# Altium project PPT_Cap_Charger.PrjPcb
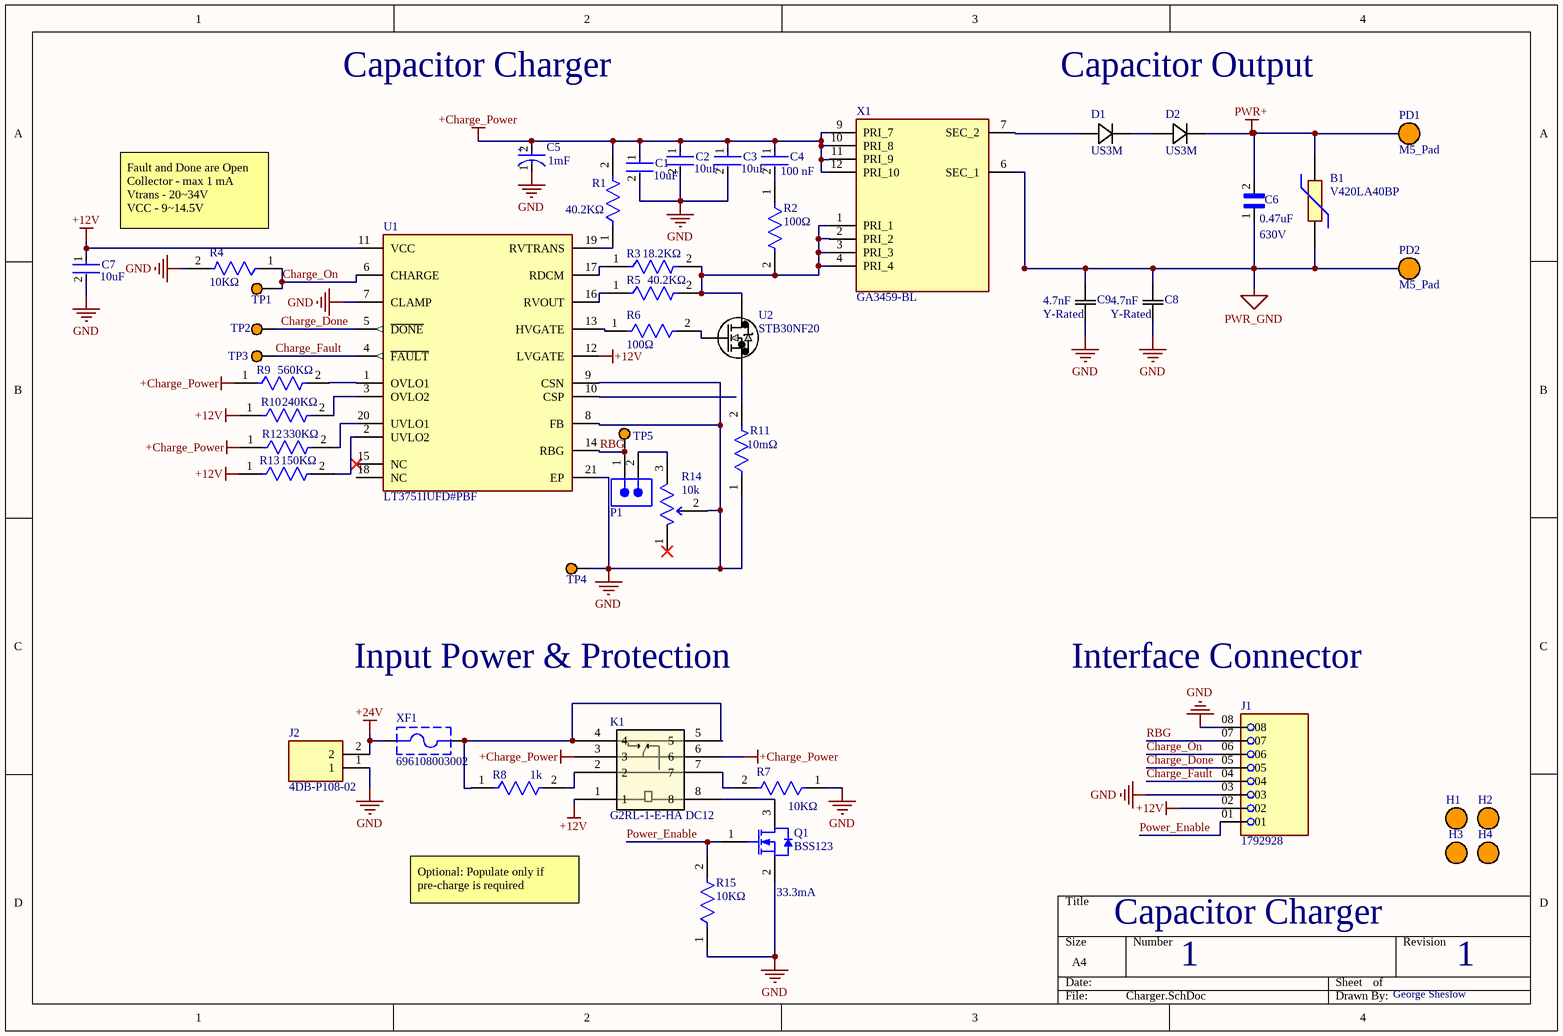
[diagram p0: Charger.SchDoc]
1 sheet, 47 parts. Net scope: global (net labels, ports and power ports of the same name join across sheets).
Board file: Charger.PcbDoc

## Sheet Charger.SchDoc
size A4; SheetNumber: 1; SheetTotal: 1

### Parts
B1  V420LA40BP  [V420LA40BP]
C1  Capacitance: 10uF  [FP-CL32-IPC_C]  (hidden comment: CL32B106KBJNNNE)
C2  Capacitance: 10uF  [FP-CL32-IPC_C]  (hidden comment: CL32B106KBJNNNE)
C3  Capacitance: 10uF  [FP-CL32-IPC_C]  (hidden comment: CL32B106KBJNNNE)
C4  Capacitance: 100 nF  [FP-CC0603-DA-MFG]  (hidden comment: CC0603KRX7R9BB104)
C5  Capacitance: 1mF  [FP-RAD-TH-D_12_5_0_5-L_25-MFG]  (hidden comment: ECA1HM102)
C6  value 0.47uF  voltage: 630V  [CAPC6050X550N]  (hidden comment: CKG57NX7R2J474M500JH)
C7  Capacitance: 10uF  [FP-CL32-IPC_C]  (hidden comment: CL32B106KBJNNNE)
C8  capacitance: 4.7nF  rating: Y-Rated  [CAP_5.0 X 11.0 X 13.0_EPC]  (hidden comment: B32021A3472M189)
C9  capacitance: 4.7nF  rating: Y-Rated  [CAP_5.0 X 11.0 X 13.0_EPC]  (hidden comment: B32021A3472M189)
D1  US3M  [DO-214AB_SMC]
D2  US3M  [DO-214AB_SMC]
H1  M3_Hole  [M3_Hole]  (value not drawn)
H2  M3_Hole  [M3_Hole]  (value not drawn)
H3  M3_Hole  [M3_Hole]  (value not drawn)
H4  M3_Hole  [M3_Hole]  (value not drawn)
J1  1792928  [PHOENIX_1792928]
J2  4DB-P108-02  [TE_2-1437667-4]
K1  G2RL-1-E-HA DC12  [RELAY_G2RL-1-E DC5_OMR]
P1  TSW-102-26-F-S  [SMTC-TSW-102-26-XX-S]  (value not drawn)
PD1  M5_Pad  [M5_Pad]
PD2  M5_Pad  [M5_Pad]
Q1  BSS123  [FAIR-SOT23-3_V]
R1  Resistance: 40.2KΩ  [FP-RT0805-MFG]  (hidden comment: RT0805BRE0740K2L)
R2  Resistance: 100Ω  [FP-RT0805-MFG]  (hidden comment: RT0805FRE07100RL)
R3  Resistance: 18.2KΩ  [FP-RT0805-MFG]  (hidden comment: RT0805BRE0718K2L)
R4  value 10KΩ  [FP-RT0805-MFG]  (hidden comment: RT0805FRE0710KL)
R5  Resistance: 40.2KΩ  [FP-RT0805-MFG]  (hidden comment: RT0805BRE0740K2L)
R6  Resistance: 100Ω  [FP-RT0805-MFG]  (hidden comment: RT0805FRE07100RL)
R7  value 10KΩ  [FP-RT0805-MFG]  (hidden comment: RT0805FRE0710KL)
R8  Resistance: 1k  [FP-CRCW2512-e3-IPC_A]  (hidden comment: CRCW25121K00JNEG)
R9  Resistance: 560KΩ  [FP-RT0805-MFG]  (hidden comment: RT0805FRE07560KL)
R10  Resistance: 240KΩ  [FP-RT0805-MFG]  (hidden comment: RT0805BRE07240KL)
R11  Resistance: 10mΩ  [FP-PCS2512-MFG]  (hidden comment: PCS2512DR0100ET)
R12  value 330KΩ  [FP-RT0805-MFG]  (hidden comment: RT0805FRE07330KL)
R13  value 150KΩ  [FP-RT0805-MFG]  (hidden comment: RT0805BRE07150KL)
R14  Resistance: 10k  [FP-3296W-MFG]  (hidden comment: 3296W-1-103RLF)
R15  value 10KΩ  [FP-RT0805-MFG]  (hidden comment: RT0805FRE0710KL)
TP1  Test Point  [Test_Pad]  (value not drawn)
TP2  Test Point  [Test_Pad]  (value not drawn)
TP3  Test Point  [Test_Pad]  (value not drawn)
TP4  Test Point  [Test_Pad]  (value not drawn)
TP5  Test Point  [Test_Pad]  (value not drawn)
U1  LT3751IUFD#PBF  [FP-UFD-20-05-08-1711-MFG]
U2  STB30NF20  [D2PAK_STM]
X1  GA3459-BL  [GA3459BL]
XF1  696108003002  [696108003002]

### Nets
+12V: C7.1 J1.02 K1.1 R10.1 R13.1 U1.11(VCC) U1.12(LVGATE)
+24V: J2.2 XF1.1
+Charge_Power: C1.1 C2.1 C3.1 C4.1 C5.2(A) K1.3 K1.6 R1.2 R9.1 R12.1 X1.9(PRI_7) X1.10(PRI_8) X1.11(PRI_9) X1.12(PRI_10)
GND: C1.2 C2.2 C3.2 C5.1(C) C7.2 C8.1 C9.1 J1.03 J1.08 J2.1 Q1.2(S) R4.2 R7.1 R11.1 R14.2(WIPER) R15.1 TP4.1(T) U1.7(CLAMP) U1.8(FB) U1.9(CSN) U1.21(EP)
PWR+: B1.2 C6.2 D2.K PD1.1
PWR_GND: B1.1 C6.1 C8.2 C9.2 PD2.1 X1.6(SEC_1)
Charge_Done: J1.05 TP2.1(T) U1.5(~{DONE})
Charge_Fault: J1.04 TP3.1(T) U1.4(~{FAULT})
Charge_On: J1.06 R4.1 TP1.1(T) U1.6(CHARGE)
Power_Enable: J1.01 Q1.1(G) R15.2
RBG: J1.07 P1.1 TP5.1(T) U1.14(RBG)
NetC4_2: C4.2 R2.1
NetD1_A: D1.A X1.7(SEC_2)
NetD1_K: D1.K D2.A
NetK1_2: K1.2 R8.2
NetK1_4: K1.4 K1.5 R8.1 XF1.2
NetK1_7: K1.7 R7.2
NetK1_8: K1.8 Q1.3(D)
NetP1_2: P1.2 R14.3(CW)
NetR1_1: R1.1 U1.19(RVTRANS)
NetR2_2: R2.2 R3.2 R5.2 U2.2 X1.1(PRI_1) X1.2(PRI_2) X1.3(PRI_3) X1.4(PRI_4)
NetR3_1: R3.1 U1.17(RDCM)
NetR5_1: R5.1 U1.16(RVOUT)
NetR6_1: R6.1 U1.13(HVGATE)
NetR6_2: R6.2 U2.1
NetR9_2: R9.2 U1.1(OVLO1)
NetR10_2: R10.2 U1.3(OVLO2)
NetR11_2: R11.2 U2.3
NetR12_2: R12.2 U1.20(UVLO1)
NetR13_2: R13.2 U1.2(UVLO2)

Not connected (* = marked no-connect by the designer): R14 1(CCW)*; U1 10(CSP) 15(NC)* 18(NC)

### Notes on the sheet
- Capacitor Charger
- Capacitor Output
- Fault and Done are Open Collector - max 1 mA
  Vtrans - 20~34V
  VCC - 9~14.5V
- Input Power & Protection
- (near J1) Interface Connector
- Optional: Populate only if pre-charge is required
- (near Q1) 33.3mA
- 1
- George Sheslow
- (in symbol CMP-05427-001975-1) +

### Library data of the parts
B1 = V420LA40BP: Littelfuse LA Series Variable Resistor 600pF 100A, Clamping 1060V, Varistor 610  720V; Geometry.Height: 28mm; Mouser Part Number: 576-V420LA40BP; Mouser Price/Stock: https://www.mouser.co.uk/ProductDetail/Littelfuse/V420LA40BP?qs=%252BvNVc1OwqXLcs1GzcX8aHQ%3D%3D; Manufacturer_Name: LITTELFUSE; Manufacturer_Part_Number: V420LA40BP; Datasheet Link: https://www.littelfuse.com/~/media/electronics/datasheets/varistors/littelfuse_varistor_la_datasheet.pdf.pdf
C1-C3 C7 = CMP-2000-06110-2: Cap Ceramic 10uF 50V X7R ±10% SMD 1210 +125°C Embossed T/R; Material: Ceramic; Min Operating Temperature: -55°C; Depth: 2.5mm; Radiation Hardening: No; Packaging: Tape and Reel; Dielectric: X7R; Case Code (Metric): 3225; Height: 2.5mm; Thickness: 0.106inch; Voltage Rating (DC): 50V; Voltage Rating: 50V; Width: 0.098inch; Case Code (Imperial): 1210; Length: 3.2mm; Tolerance: 10%; Lead Free: Lead Free; Package Quantity: 1; Voltage: 50V; Mount: Surface Mount; Case/Package: 1210; Max Operating Temperature: 125°C
C4 = CMP-2100-03601-2: CAP CER 0.1UF 50V X7R 0603; Manufacturer: YAGEO; Material: Ceramic; Temperature Coefficient: 15%; Tolerance: 0.1; Value: 100 nF; Height: 0.9mm; Voltage: 50 V; ComponentLink2Description: Datasheet; Device Class L2: Capacitors; Temperature Range High: +125°C; Category: Cap; Footprint Url: http://www.yageo.com/exep/pages/download/literatures/UPY-C_GEN_24.pdf; ComponentLink2URL: http://www.yageo.com/documents/recent/UPY-GPHC_X7R_6.3V-to-50V_18.pdf; Package: CC0603-DA; Temperature: -55°C to +125°C; Voltage Rating: 50 V; Temperature Characteristic: X7R; Device Class L1: Passive Components; Temperature Range Low: -55°C; Manufacturer Part Number: CC0603KRX7R9BB104; RoHS: TRUE; Automotive: No; Device Class L3: Ceramic Capacitors; Octopart: https://octopart.com/cc0603krx7r9bb104-yageo-42244635; Mouser Description: Multilayer Ceramic Capacitor, CC Series, 0.1 - F, - 10%, X7R, 50 V, 0603 [1608 Metric]; Lead Free: Yes; Digikey Description: CAP CER 0.1UF 50V X7R 0603
C5 = CMP-05427-001975-1: Aluminum Electrolytic Capacitors (Radial Lead Type) 1000uF ±20% 50V; Lead Diameter: 0.6mm; Polarity: Polar; Lead/Base Style: Straight; Ripple Current: 1.05A; Life (Hours): 2000Hour; Dissipation Factor: 0.12%; Diameter: 12.5mm; Height: 25mm; Construction: RADIAL; Voltage Rating (DC): 50V; Tolerance: 20%; Package Quantity: 200; Min Operating Temperature: -40°C; Packaging: Bulk; Max Operating Temperature: 85°C; Case/Package: Radial; Radiation Hardening: No; Mount: Through Hole; Length: 25mm; Termination: Radial; Voltage Rating: 50V; RoHS Compliant: Yes; Height - Seated (Max): 1.063inch; REACH SVHC: No SVHC; Series: M; Lead Pitch: 5mm
C6 = CKG57NX7R2J474M500JH: 0.47ÂµF Â±20% 630V Ceramic Capacitor X7R Stacked SMD, 2 J-Lead; MF: TDK; Price: None; Purchase-URL: https://pricing.snapeda.com/search/part/CKG57NX7R2J474M500JH/?ref=eda; Check_prices: https://www.snapeda.com/parts/CKG57NX7R2J474M500JH/TDK/view-part/?ref=eda; Package: 6050 TDK; Availability: In Stock; SnapEDA_Link: https://www.snapeda.com/parts/CKG57NX7R2J474M500JH/TDK/view-part/?ref=snap; MP: CKG57NX7R2J474M500JH
C8 C9 = B32021A3472M189: No Description Available; Manufacturer_Name: TDK Epcos; Copyright: Copyright (C) 2025 Ultra Librarian. All rights reserved.; Manufacturer_Part_Number: B32021A3472M189
D1 D2 = US3M: Rectifier Diode, 1 Phase, 1 Element, 3A, 1000V V(RRM), Silicon, DO-214AB; Manufacturer: Diotec; Package Body Material: Plastic; Application(s): GENERAL PURPOSE; Forward Voltage: 1.7V; Non-rep Pk Forward Current-Max: 100A; Number of Elements: 1; Rep Pk Reverse Voltage-Max: 1kV; Reverse Recovery Time-Max: 0.075us; Qualification Status: Not Qualified; Supplier: Mouser; Supplier Part Number: 637-US3M; Manufacturer Part Number: US3M; RoHS: Yes; Category: Rectifier Diodes; Stock: 6011; Pricing: 1=0.4, 10=0.317, 50=0.317, 100=0.19, 1000=0.182, 10000=0.13 (USD); Pins: 2; Diode Element Material: SILICON; Package Shape: Rectangular; Terminal Finish: Tin; Min Operating Temperature: -50°C; Max Operating Temperature: 150°C; Diode Type: RECTIFIER; JESD-30 Code: R-PDSO-C2; Number of Phases: 1; Max Output current: 3A; Package Style: SMALL OUTLINEMeter; Surface Mount: Yes; Terminal Form: C BEND; Terminal Position: DUAL; JESD-609 Code: e3; Moisture Sensitivity Level: 1; Peak Reflow Temperature (Cel): 260°C; RoHS Compliant: Yes; Reach SVHC Compliant: No; JEDEC-95 Code: DO-214AB; ComponentLink1URL: https://datasheet.ciiva.com:443/pdfs/VipMasterIC/IC/DISE/DISE-S-A0001232619/DISE-S-A0001232619-1.pdf?src-supplier=IHS+Markit; ComponentLink1Description: https://datasheet.ciiva.com:443/pdfs/VipMasterIC/IC/DISE/DISE-S-A0001232619/DISE-S-A0001232619-1.pdf?src-supplier=IHS+Markit; ComponentLink2URL: https://datasheet.octopart.com/US3M-Diotec-datasheet-155920030.pdf?src-supplier=TME; ComponentLink2Description: https://datasheet.octopart.com/US3M-Diotec-datasheet-155920030.pdf?src-supplier=TME
J2 = 4DB-P108-02: Conn; Term Strip; Barrier; 2Pole; 8.26mmPitch; SnglRow; 22-12; Series 4DB; 20A; 150V; MF: TE Connectivity; Value: *; MP: 4DB-P108-02; TE_purchase_URL: https://www.te.com/usa-en/product-2-1437667-4.html?te_bu=Cor&te_type=disp&te_campaign=seda_glo_cor-seda-global-disp-prtnr-fy19-seda-model-bom-cta_sma-317_1&elqCampaignId=32493; Package: None; Price: None; Availability: Unavailable; SnapEDA_Link: https://www.snapeda.com/parts/4DB-P108-02/TE%20Connectivity%20AMP%20Connectors/view-part/2743721/?ref=snap
K1 = G2RL-1-E-HA DC12: No Description Available; Manufacturer_Name: Omron; Copyright: Copyright (C) 2025 Ultra Librarian. All rights reserved.; Manufacturer_Part_Number: G2RL-1-E-HA DC12; RefDes: RefDes; Type: Type
P1 = CMP-1024-00329-1: 0.025" SQ Post Header, Through-hole, Vertical, -55 to 125 degC, 2.54 mm Pitch, 2-Pin, Male, RoHS; Manufacturer: Samtec; Pitch: 2.54 mm; PackageVersion: DM, 8/1988; ComponentLink2Description: Datasheet; PackageReference: TSW-102-26-XX-S; ComponentLink3URL: http://www.samtec.com/documents/webfiles/cpdf/TSW-XXX-XX-XXX-X-XX-XXX-MKT.pdf; ComponentLink2URL: http://www.samtec.com/documents/webfiles/pdf/TSW_TH.PDF; ComponentLink1Description: Manufacturer URL; DatasheetVersion: F-214; RoHS: True; ComponentLink3Description: Package Specification; PartNumber: TSW-102-26-F-S; Temperature Range: -55 to 125 degC; Orientation: Vertical; ComponentLink1URL: http://www.samtec.com; PackageDescription: .025[0.64] SQ. Post Terminal Strip Assembly; Mounting Technology: Through-hole
Q1 = CMP-2000-04934-1: N-Channel Logic Level Enhancement Mode Field Effect Transistor, 1.7 V, -55 to 150 degC, 3-Pin SOT-23, RoHS, Tape and Reel; Manufacturer: Fairchild; Channel Type: N; Typical Turn-Off Delay Time: 17ns; Maximum Continuous Drain Current: 0.17A; Rad Hard: No; Typical Rise Time: 9ns; Typical Fall Time: 2.4ns; Maximum Gate Source Voltage: ±20V; Maximum Drain Source Voltage: 100V; Typical Turn-On Delay Time: 1.7ns; RDS-on: 6000@10VmOhm; Package Version: Rev. 12, 03/2016; Packaging: Tape&Reel; Package Reference: SOT23-3; Channel Mode: Enhancement; Operating Temperature: -55to150degC; Package Description: 3-Pin Small Outline Transistor, Body 2.92 x 1.325 mm, Pitch 0.95 mm; Category: MOSFET; Datasheet Version: Jun-03; Datasheet URL: https://www.fairchildsemi.com/datasheets/BS/BSS123.pdf; Manufacturer URL: https://www.fairchildsemi.com/; Mounting: SurfaceMount; Package: 3SOT-23; Package URL: http://www.fairchildsemi.com/dwg/MA/MA03D.pdf
R1 R5 = CMP-2001-01705-2: RES SMD 40.2K OHM 0.1% 1/8W 0805; Manufacturer: Yageo; Tolerance: 0.0025; Power Rating: 0.125W; Value: 40.2KΩ; Temperature Coefficient: 50 ppm/°C; Voltage Rating: 150V; Temperature Range High: +155°C; Digikey Description: RES SMD 40.2K OHM 0.1% 1/8W 0805; Height: 0.6mm; Temperature: -55°C to +155°C; Manufacturer Part Number: RT0805BRE0740K2L; RoHS: TRUE; ComponentLink2URL: http://www.yageo.com/documents/recent/PYu-RT_1-to-0.01_RoHS_L_9.pdf; Footprint Url: http://www.yageo.com/exep/pages/download/literatures/PYu-R_Mount_10.pdf; Package: RT0805; Lead Free: Yes; Device Class L3: Chip SMD Resistors; Device Class L2: Resistors; ComponentLink2Description: Datasheet; Series: RT; Composition: Thin Film; Automotive: No; Category: Res; Ipc Land Pattern Name: RESC200125X50; Octopart: https://octopart.com/rt0805bre0740k2l-yageo-1373674; Temperature Range Low: -55°C; Device Class L1: Passive Components
R2 R6 = CMP-03412-013069-1: RES SMD 100 OHM 1% 1/8W 0805; Manufacturer: Yageo; Voltage Rating: 150V; Temperature Coefficient: 50 ppm/°C; Tolerance: 0.0001; Power Rating: 0.125W; Value: 100Ω; Device Class L1: Passive Components; RoHS: TRUE; Digikey Description: RES SMD 100 OHM 1% 1/8W 0805; Composition: Thin Film; Mouser Description: Thin Film Resistors 100 OHM 1% 50PPM; Category: Res; Temperature Range High: +155°C; Series: RT; Octopart: https://octopart.com/rt0805fre07100rl-yageo-39834046; Lead Free: Yes; Height: 0.6mm; Package: RT0805; Automotive: No; Footprint Url: http://www.yageo.com/exep/pages/download/literatures/PYu-R_Mount_10.pdf; Device Class L2: Resistors; ComponentLink2Description: Datasheet; Manufacturer Part Number: RT0805FRE07100RL; Temperature: -55°C to +155°C; Device Class L3: Chip SMD Resistors; Ipc Land Pattern Name: RESC200125X50; ComponentLink2URL: http://www.yageo.com/documents/recent/PYu-RT_1-to-0.01_RoHS_L_9.pdf; Temperature Range Low: -55°C
R3 = CMP-03412-033419-1: RES SMD 18.2K OHM 0.1% 1/8W 0805; Manufacturer: Yageo; Tolerance: 0.0025; Voltage Rating: 150V; Power Rating: 0.125W; Temperature Coefficient: 50 ppm/°C; Value: 18.2KΩ; Footprint Url: http://www.yageo.com/exep/pages/download/literatures/PYu-R_Mount_10.pdf; RoHS: TRUE; Package: RT0805; Digikey Description: RES SMD 18.2K OHM 0.1% 1/8W 0805; Device Class L2: Resistors; Category: Res; Device Class L1: Passive Components; Lead Free: Yes; Device Class L3: Chip SMD Resistors; Ipc Land Pattern Name: RESC200125X50; Series: RT; Temperature: -55°C to +155°C; ComponentLink2Description: Datasheet; Composition: Thin Film; ComponentLink2URL: http://www.yageo.com/documents/recent/PYu-RT_1-to-0.01_RoHS_L_9.pdf; Temperature Range Low: -55°C; Height: 0.6mm; Automotive: No; Temperature Range High: +155°C; Manufacturer Part Number: RT0805BRE0718K2L; Octopart: https://octopart.com/rt0805bre0718k2l-yageo-1165173
R4 R7 R15 = CMP-03412-023097-1: RES 10.0K OHM 1/8W 1% SMD 0805; Manufacturer: Yageo; Tolerance: 0.0001; Temperature Coefficient: 50 ppm/°C; Power Rating: 0.125W; Voltage Rating: 150V; ComponentLink2Description: Datasheet; Temperature: -55°C to +155°C; Digikey Description: RES 10.0K OHM 1/8W 1% SMD 0805; Automotive: No; Octopart: https://octopart.com/rt0805fre0710kl-yageo-40301150; Composition: Thin Film; Resistance: 10KΩ; RoHS: TRUE; Category: Res; Device Class L2: Resistors; Package: RT0805; ComponentLink2URL: http://www.yageo.com/documents/recent/PYu-RT_1-to-0.01_RoHS_L_9.pdf; Ipc Land Pattern Name: RESC200125X50; Height: 0.6mm; Footprint Url: http://www.yageo.com/exep/pages/download/literatures/PYu-R_Mount_10.pdf; Device Class L3: Chip SMD Resistors; Manufacturer Part Number: RT0805FRE0710KL; Temperature Range High: +155°C; Lead Free: Yes; Mouser Description: Thin Film Resistors 1/8W 10K ohm 1% 50ppm; Temperature Range Low: -55°C; Series: RT; Device Class L1: Passive Components
R8 = CMP-1018-00074-2: RES Thick Film, 1kΩ, 5%, 1W, 200ppm/°C, 2512; Voltage Rating (DC): 500V; Power Rating: 1W; Radiation Hardening: No; Features: Automotive AEC-Q200; Length: 6.3mm; Max Operating Temperature: 155°C; Max Power Dissipation: 1W; Min Operating Temperature: -55°C; Number of Terminations: 2; Case Code (Metric): 6432; Case/Package: 2512; Case Code (Imperial): 2512; Working Voltage: 500V; Number of Pins: 2; Composition: Thick Film; Weight: 0.001429oz; Mount: Surface Mount; Lead Free: Lead Free; Voltage Rating: 500V; Military Standard: Not; Package Quantity: 1; Depth: 3.15mm; Packaging: Tape and Reel; Height: 0.028inch; Contact Plating: Tin; Termination: SMD/SMT; Temperature Coefficient: 200ppm/°C; Tolerance: 5%; Width: 0.124inch
R9 = CMP-03412-005329-1: RES SMD 560K OHM 1% 1/8W 0805; Manufacturer: Yageo; Temperature Coefficient: 50 ppm/°C; Power Rating: 0.125W; Value: 560KΩ; Tolerance: 0.0001; Voltage Rating: 150V; Series: RT; Temperature Range Low: -55°C; Temperature: -55°C to +155°C; Device Class L3: Chip SMD Resistors; RoHS: TRUE; Temperature Range High: +155°C; ComponentLink2URL: http://www.yageo.com/documents/recent/PYu-RT_1-to-0.01_RoHS_L_9.pdf; Manufacturer Part Number: RT0805FRE07560KL; Package: RT0805; Footprint Url: http://www.yageo.com/exep/pages/download/literatures/PYu-R_Mount_10.pdf; Composition: Thin Film; Digikey Description: RES SMD 560K OHM 1% 1/8W 0805; Device Class L2: Resistors; Height: 0.6mm; Octopart: https://octopart.com/rt0805fre07560kl-yageo-40032515; Category: Res; ComponentLink2Description: Datasheet; Lead Free: Yes; Automotive: No; Device Class L1: Passive Components; Ipc Land Pattern Name: RESC200125X50
R10 = CMP-2001-01771-2: RES SMD 240K OHM 0.1% 1/8W 0805; Manufacturer: Yageo; Temperature Coefficient: 50 ppm/°C; Voltage Rating: 150V; Tolerance: 0.0025; Power Rating: 0.125W; Value: 240KΩ; Package: RT0805; Automotive: No; Footprint Url: http://www.yageo.com/exep/pages/download/literatures/PYu-R_Mount_10.pdf; RoHS: TRUE; Height: 0.6mm; ComponentLink2URL: http://www.yageo.com/documents/recent/PYu-RT_1-to-0.01_RoHS_L_9.pdf; Ipc Land Pattern Name: RESC200125X50; Temperature Range High: +155°C; Category: Res; Device Class L3: Chip SMD Resistors; Device Class L1: Passive Components; Digikey Description: RES SMD 240K OHM 0.1% 1/8W 0805; Lead Free: Yes; Temperature Range Low: -55°C; Octopart: https://octopart.com/rt0805bre07240kl-yageo-1285131; Manufacturer Part Number: RT0805BRE07240KL; Composition: Thin Film; Temperature: -55°C to +155°C; Device Class L2: Resistors; ComponentLink2Description: Datasheet; Series: RT
R11 = CMP-33361-000001-1: 2W 0.010 OHMS 0.5% 2512; Manufacturer: Ohmite; Temperature Coefficient: 50ppm/°C; Automotive Grade: Grade 0; Tolerance: 0.%; Value: 10mΩ; ComponentLink2Description: Datasheet; Device Class L3: Chip SMD Resistors; Temperature Range Low: -55°C; Octopart: https://octopart.com/pcs2512dr0100et-ohmite-106082038; Power Rating: 2W; Composition: Metal Film; Temperature Range High: +170°C; Automotive: Yes; Manufacturer Part Number: PCS2512DR0100ET; Package: PCS2512; Series: PCS; Device Class L2: Resistors; Device Class L1: Passive Components; Lead Free: Yes; Category: Res; Height: 0.664mm; Ipc Land Pattern Name: RESC635305X41; RoHS: TRUE; Temperature: -55°C to +170°C; Digikey Description: 2W 0.010 OHMS 0.5% 2512; ComponentLink2URL: https://www.ohmite.com/assets/docs/res_pcs.pdf?r=false
R12 = CMP-03412-027604-1: RES SMD 330K OHM 1% 1/8W 0805; Manufacturer: Yageo; Power Rating: 0.125W; Voltage Rating: 150V; Tolerance: 0.0001; Temperature Coefficient: 50 ppm/°C; Package: RT0805; Series: RT; ComponentLink2URL: http://www.yageo.com/documents/recent/PYu-RT_1-to-0.01_RoHS_L_9.pdf; Temperature: -55°C to +155°C; Octopart: https://octopart.com/rt0805fre07330kl-yageo-39865806; ComponentLink2Description: Datasheet; Device Class L3: Chip SMD Resistors; Mouser Description: Thin Film Resistors - SMD 1/8W 330K ohm 1% 50ppm; Device Class L2: Resistors; Lead Free: Yes; Digikey Description: RES SMD 330K OHM 1% 1/8W 0805; Temperature Range Low: -55°C; Height: 0.6mm; RoHS: TRUE; Device Class L1: Passive Components; Footprint Url: http://www.yageo.com/exep/pages/download/literatures/PYu-R_Mount_10.pdf; Temperature Range High: +155°C; Automotive: No; Ipc Land Pattern Name: RESC200125X50; Category: Res; Resistance: 330KΩ; Composition: Thin Film; Manufacturer Part Number: RT0805FRE07330KL
R13 = CMP-2001-01597-2: RES SMD 150K OHM 0.1% 1/8W 0805; Manufacturer: Yageo; Power Rating: 0.125W; Temperature Coefficient: 50 ppm/°C; Tolerance: 0.0025; Voltage Rating: 150V; Ipc Land Pattern Name: RESC200125X50; Octopart: https://octopart.com/rt0805bre07150kl-yageo-1467075; Category: Res; Height: 0.6mm; Digikey Description: RES SMD 150K OHM 0.1% 1/8W 0805; Package: RT0805; Series: RT; Temperature: -55°C to +155°C; Automotive: No; Resistance: 150KΩ; Lead Free: Yes; Device Class L1: Passive Components; Footprint Url: http://www.yageo.com/exep/pages/download/literatures/PYu-R_Mount_10.pdf; ComponentLink2URL: http://www.yageo.com/documents/recent/PYu-RT_1-to-0.01_RoHS_L_9.pdf; Composition: Thin Film; Manufacturer Part Number: RT0805BRE07150KL; Temperature Range High: +155°C; RoHS: TRUE; Device Class L3: Chip SMD Resistors; Device Class L2: Resistors; Temperature Range Low: -55°C; ComponentLink2Description: Datasheet
R14 = CMP-07234-000024-1: TRIMMER 10K OHM 0.5W PC PIN TOP; Temperature Coefficient: 100ppm/°C; Power Rating: 500mW; Tolerance: 10%; Number of Turns: 25; Width: 0.19inch; Termination: Pin; Radiation Hardening: No; Contact Plating: Tin; Composition: Cermet; Length: 9.53mm; Height: 0.395inch; Depth: 4.83mm; REACH SVHC: No SVHC; Weight: 0.03oz; Min Operating Temperature: -55°C; Military Standard: Not; Max Operating Temperature: 125°C; Packaging: Tape and Reel; Package Quantity: 1; Taper: Linear; Max Power Dissipation: 500mW; Mount: Through Hole
TP1-TP5 = Test Point: Just a Pad; Manufacturer: Keystone Electronics; Manufacturer Part Number: 5003; Plating: Silver; Body Material: PBT; Forward Current: 3A; Forward Voltage: 1.08V; Inside Diameter: 1.27mm; Outside Diameter: 2.54mm; Supplier: Digikey; Supplier Part Number: 36-5003-ND; RoHS: Yes; Category: Connectors; Stock: 130387; Pricing: 1=0.39, 10=0.293, 25=0.2624, 100=0.2223, 500=0.18446, 1000=0.1739, 2500=0.1542, 5000=0.14312 (USD); Mounting Technology: PCB,Through Hole; Pins: 1; Contact Material: Bronze; Contact Plating: Silver,Tin; Material: Nylon,Bronze,Silver; Color: Orange,White; Weight: 4.535924g; Package Quantity: 10; Packaging: Bulk; Series: THM; Termination: Through Hole; Length: 7.62mm; Width: 6.35mm; Height: 0.3inch; Radiation Hardening: No; Reach SVHC Compliant: No; Lead Free: Lead Free; RoHS Compliant: Yes; Flammability Rating: UL94 V-0; ComponentLink1URL: https://datasheet.ciiva.com/4598/5000-5004-4598618.pdf?src-supplier=Mouser; ComponentLink1Description: https://datasheet.ciiva.com/4598/5000-5004-4598618.pdf?src-supplier=Mouser; ComponentLink2URL: https://datasheet.ciiva.com/16885/70182825-16885788.pdf?src-supplier=Allied+Electronics; ComponentLink2Description: https://datasheet.ciiva.com/16885/70182825-16885788.pdf?src-supplier=Allied+Electronics; ComponentLink3URL: https://datasheet.ciiva.com/1454/1703983-1454826.pdf?src-supplier=Element14; ComponentLink3Description: https://datasheet.ciiva.com/1454/1703983-1454826.pdf?src-supplier=Element14; ComponentLink4URL: https://datasheet.ciiva.com/22631/1703983-22631103.pdf?src-supplier=Element14; ComponentLink4Description: https://datasheet.ciiva.com/22631/1703983-22631103.pdf?src-supplier=Element14
U1 = CMP-0491-02187-3: IC CTRLR CAP CHRGR 4.75V 20-QFN; Number of Outputs: 1; Topology: Flyback; Operating Supply Current: 5.5mA; Max Supply Voltage: 24V; REACH SVHC: No SVHC; Number of Pins: 20; Length: 5mm; Package Quantity: 73; Min Operating Temperature: -40°C; Case/Package: QFN; Min Supply Voltage: 4.75V; Max Operating Temperature: 125°C; Packaging: Rail/Tube; RoHS Compliant: Yes
U2 = STB30NF20: N-channel 200 V, 0.065 Ohm, 30 A, D2PAK STripFET(TM) Power MOSFET; Manufacturer_Name: STMicroelectronics; Copyright: Copyright (C) 2025 Ultra Librarian. All rights reserved.; Manufacturer_Part_Number: STB30NF20; Datasheet: https://www.st.com/resource/en/datasheet/stp30nf20.pdf
X1 = GA3459-BL: Audio Transformers / Signal Transformers GA3459 for LT3751 500V 20A; Manufacturer_Name: COILCRAFT; Geometry.Height: 14mm; Mouser Part Number: 994-GA3459-BL; Mouser Price/Stock: https://www.mouser.co.uk/ProductDetail/Coilcraft/GA3459-BL?qs=ZYnrCdKdyecGrzi6ofbvIw%3D%3D; Manufacturer_Part_Number: GA3459-BL; Datasheet Link: https://www.coilcraft.com/pdfs/ga3459.pdf
XF1 = 696108003002: NexarPartId: 56808807; Voltage Rating (AC): 250V; Fuse Current: 10A; REACH SVHC: Unknown; RoHS: Non-Compliant; Mount: Through Hole; Packaging: Box
J1 = 1792928: Package: None; Price: None; Value: *; MP: 1792928; Availability: Unavailable